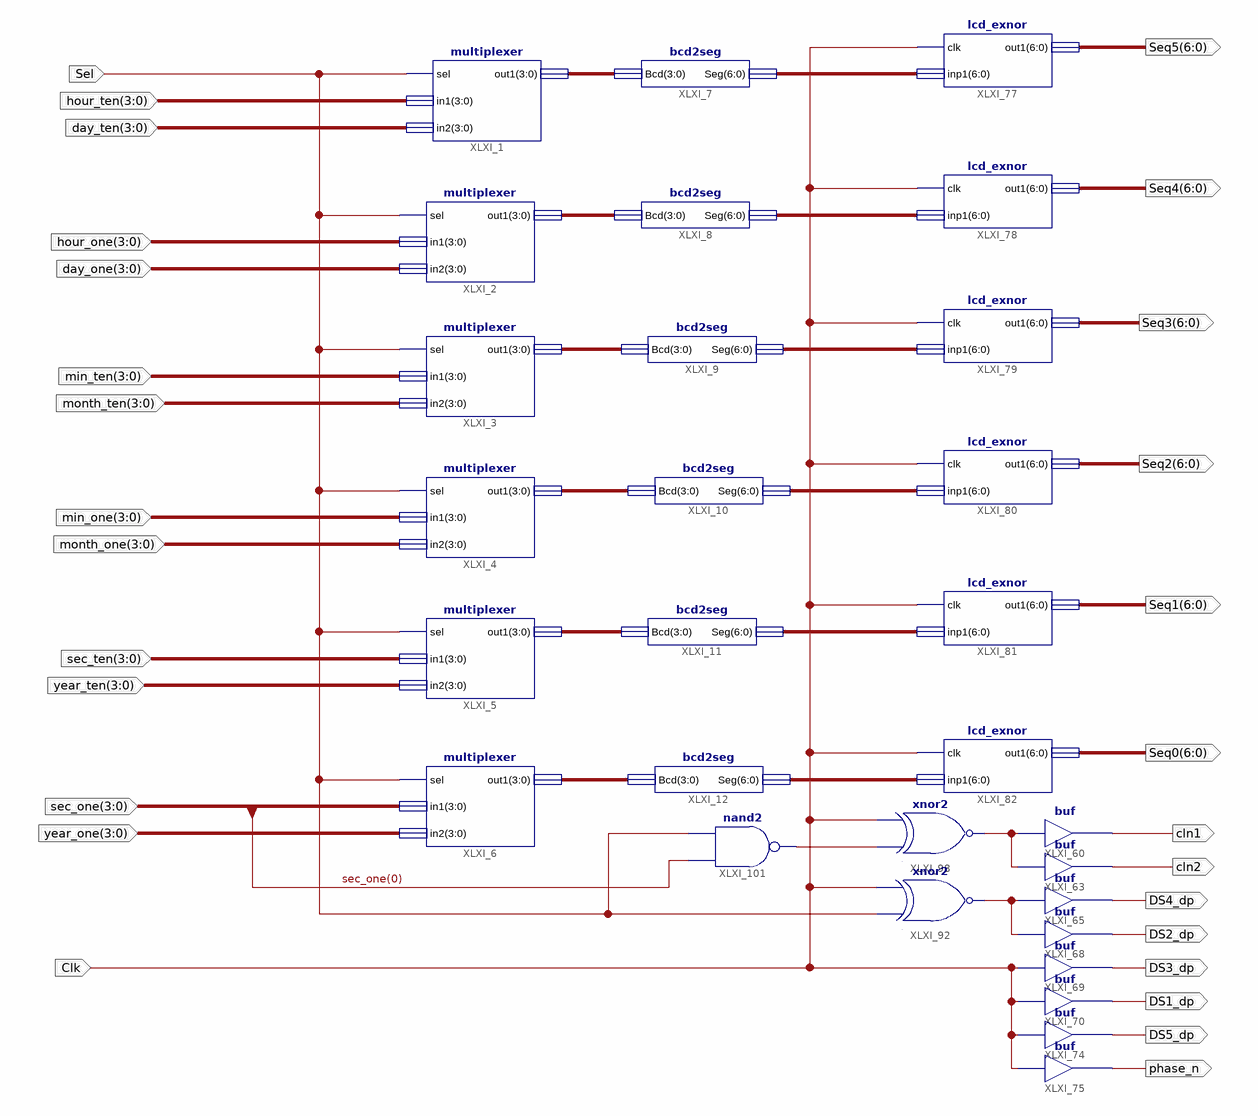
[diagram p0: schematic sheet 1]
// Xilinx ISE schematic display_module.sch (xbr) as structural Verilog: 29 symbols, 28 ports
module display_module (
  input  Sel,
  input  [3:0] year_ten,
  input  [3:0] sec_ten,
  input  [3:0] month_one,
  input  [3:0] hour_ten,
  input  [3:0] day_ten,
  input  [3:0] min_ten,
  input  [3:0] month_ten,
  input  [3:0] min_one,
  input  [3:0] hour_one,
  input  [3:0] day_one,
  input  [3:0] sec_one,
  input  [3:0] year_one,
  input  Clk,
  output [6:0] Seq3,
  output [6:0] Seq5,
  output [6:0] Seq4,
  output [6:0] Seq2,
  output [6:0] Seq1,
  output [6:0] Seq0,
  output DS4_dp,
  output DS2_dp,
  output DS3_dp,
  output DS1_dp,
  output phase_n,
  output DS5_dp,
  output cln2,
  output cln1
);

  wire XLXN_117, XLXN_126, XLXN_134;
  wire [3:0] XLXN_85, XLXN_86, XLXN_87, XLXN_90, XLXN_93, XLXN_94;
  wire [6:0] XLXN_44, XLXN_45, XLXN_46, XLXN_48, XLXN_50, XLXN_51;

  bcd2seg XLXI_7 (.Bcd(XLXN_85), .Seg(XLXN_44));
  bcd2seg XLXI_8 (.Bcd(XLXN_86), .Seg(XLXN_45));
  bcd2seg XLXI_9 (.Bcd(XLXN_87), .Seg(XLXN_46));
  bcd2seg XLXI_10 (.Bcd(XLXN_90), .Seg(XLXN_48));
  bcd2seg XLXI_11 (.Bcd(XLXN_94), .Seg(XLXN_50));
  bcd2seg XLXI_12 (.Bcd(XLXN_93), .Seg(XLXN_51));
  multiplexer XLXI_3 (.sel(Sel), .in1(min_ten), .in2(month_ten), .out1(XLXN_87));
  multiplexer XLXI_4 (.sel(Sel), .in1(min_one), .in2(month_one), .out1(XLXN_90));
  multiplexer XLXI_5 (.sel(Sel), .in1(sec_ten), .in2(year_ten), .out1(XLXN_94));
  multiplexer XLXI_6 (.sel(Sel), .in1(sec_one), .in2(year_one), .out1(XLXN_93));
  multiplexer XLXI_2 (.sel(Sel), .in1(hour_one), .in2(day_one), .out1(XLXN_86));
  multiplexer XLXI_1 (.sel(Sel), .in1(hour_ten), .in2(day_ten), .out1(XLXN_85));
  buf XLXI_65 (DS4_dp, XLXN_126);
  buf XLXI_68 (DS2_dp, XLXN_126);
  buf XLXI_69 (DS3_dp, Clk);
  buf XLXI_70 (DS1_dp, Clk);
  buf XLXI_74 (DS5_dp, Clk);
  buf XLXI_75 (phase_n, Clk);
  lcd_exnor XLXI_77 (.clk(Clk), .inp1(XLXN_44), .out1(Seq5));
  lcd_exnor XLXI_78 (.clk(Clk), .inp1(XLXN_45), .out1(Seq4));
  lcd_exnor XLXI_79 (.clk(Clk), .inp1(XLXN_46), .out1(Seq3));
  lcd_exnor XLXI_80 (.clk(Clk), .inp1(XLXN_48), .out1(Seq2));
  lcd_exnor XLXI_81 (.clk(Clk), .inp1(XLXN_50), .out1(Seq1));
  lcd_exnor XLXI_82 (.clk(Clk), .inp1(XLXN_51), .out1(Seq0));
  buf XLXI_60 (cln1, XLXN_117);
  buf XLXI_63 (cln2, XLXN_117);
  xnor XLXI_92 (XLXN_126, Sel, Clk);
  xnor XLXI_98 (XLXN_117, XLXN_134, Clk);
  nand XLXI_101 (XLXN_134, sec_one[0], Sel);
endmodule
